# Altium schematic sheet config-interface.SchDoc
size A; SheetNumber: 5; SheetTotal: 9
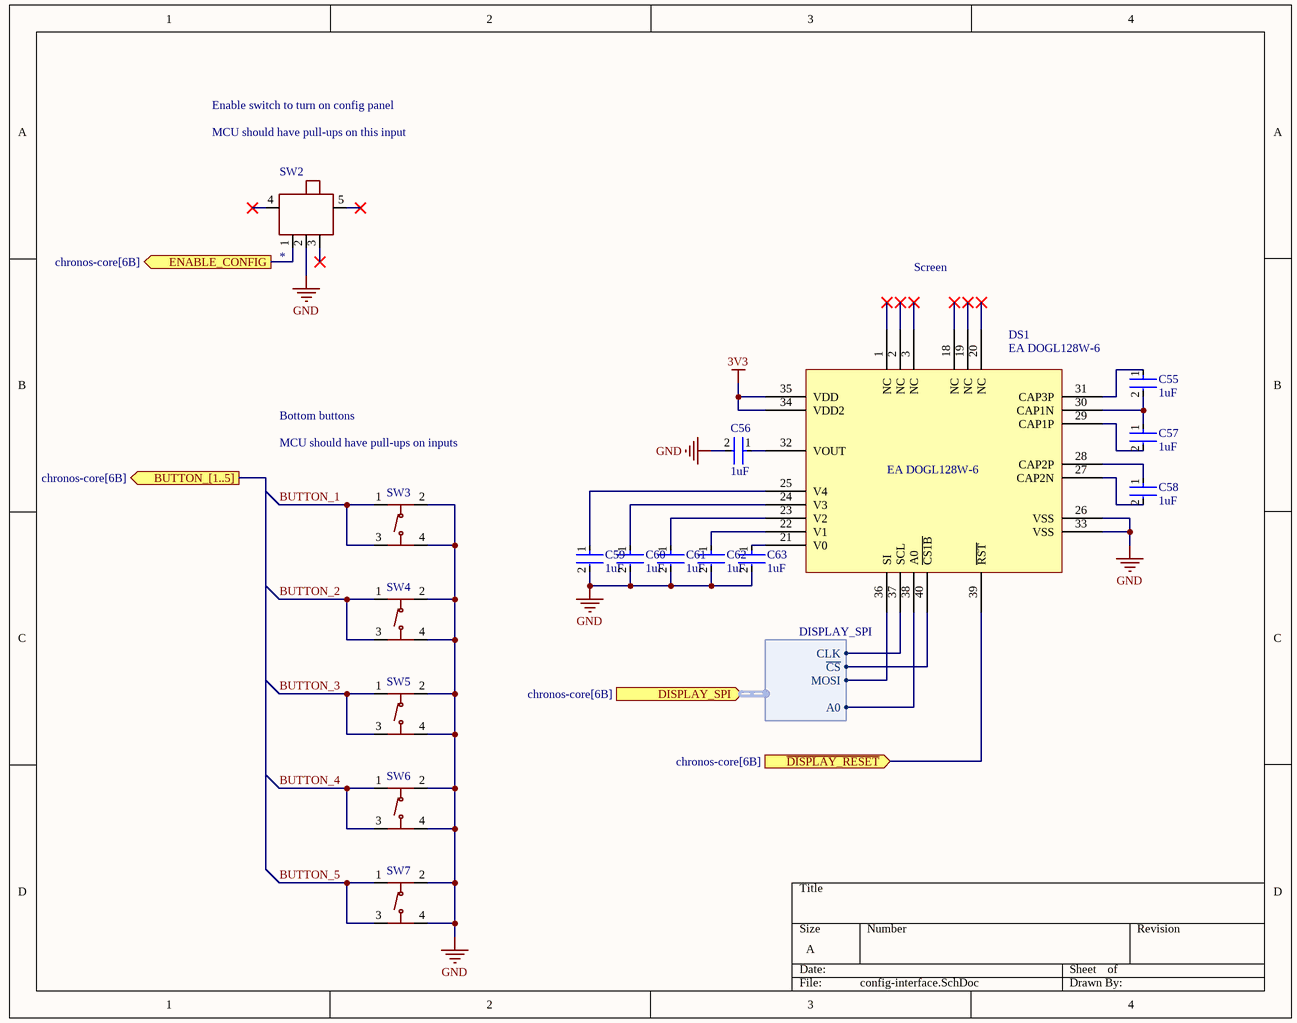
[diagram p0: config-interface.SchDoc]

## Parts
C55  Capacitance: 1uF  [FP-CL542-IPC_C]  (hidden comment: CL05A105KA5NQNC)
C56  Capacitance: 1uF  [FP-CL542-IPC_C]  (hidden comment: CL05A105KA5NQNC)
C57  Capacitance: 1uF  [FP-CL542-IPC_C]  (hidden comment: CL05A105KA5NQNC)
C58  Capacitance: 1uF  [FP-CL542-IPC_C]  (hidden comment: CL05A105KA5NQNC)
C59  Capacitance: 1uF  [FP-CL542-IPC_C]  (hidden comment: CL05A105KA5NQNC)
C60  Capacitance: 1uF  [FP-CL542-IPC_C]  (hidden comment: CL05A105KA5NQNC)
C61  Capacitance: 1uF  [FP-CL542-IPC_C]  (hidden comment: CL05A105KA5NQNC)
C62  Capacitance: 1uF  [FP-CL542-IPC_C]  (hidden comment: CL05A105KA5NQNC)
C63  Capacitance: 1uF  [FP-CL542-IPC_C]  (hidden comment: CL05A105KA5NQNC)
DS1  EA DOGL128W-6  [EA DOGL128W-6]
SW2  SS12D07VG4 087  [SS12D07VG4 087]  (value not drawn)
SW3  TS-1187A-B-A-B  [TS-1187A-B-A-B]  (value not drawn)
SW4  TS-1187A-B-A-B  [TS-1187A-B-A-B]  (value not drawn)
SW5  TS-1187A-B-A-B  [TS-1187A-B-A-B]  (value not drawn)
SW6  TS-1187A-B-A-B  [TS-1187A-B-A-B]  (value not drawn)
SW7  TS-1187A-B-A-B  [TS-1187A-B-A-B]  (value not drawn)

## Ports
BUTTON_[1..5] (out, see chronos-core[6B]), DISPLAY_SPI (in, harness DISPLAY_SPI, see chronos-core[6B]), ENABLE_CONFIG (out, see chronos-core[6B]), ~{DISPLAY_RESET} (in, see chronos-core[6B])

## Harnesses
DISPLAY_SPI: CLK, ~{CS}, MOSI, A0

## Nets
3V3: DS1.34(VDD2) DS1.35(VDD)
GND: C56.2 C59.2 C60.2 C61.2 C62.2 C63.2 DS1.26(VSS) DS1.33(VSS) SW2.2 SW3.2(B) SW3.4(D) SW4.2(B) SW4.4(D) SW5.2(B) SW5.4(D) SW6.2(B) SW6.4(D) SW7.2(B) SW7.4(D)
~{DISPLAY_RESET}: DS1.39(~{RST}) ; port ~{DISPLAY_RESET}
BUTTON_1: SW3.1(A) SW3.3(C)
BUTTON_2: SW4.1(A) SW4.3(C)
BUTTON_3: SW5.1(A) SW5.3(C)
BUTTON_4: SW6.1(A) SW6.3(C)
BUTTON_5: SW7.1(A) SW7.3(C)
ENABLE_CONFIG: SW2.1 ; port ENABLE_CONFIG
NetC55_1: C55.1 DS1.31(CAP3P)
NetC55_2: C55.2 C57.1 DS1.30(CAP1N)
NetC56_1: C56.1 DS1.32(VOUT)
NetC57_2: C57.2 DS1.29(CAP1P)
NetC58_1: C58.1 DS1.28(CAP2P)
NetC58_2: C58.2 DS1.27(CAP2N)
NetC59_1: C59.1 DS1.25(V4)
NetC60_1: C60.1 DS1.24(V3)
NetC61_1: C61.1 DS1.23(V2)
NetC62_1: C62.1 DS1.22(V1)
NetC63_1: C63.1 DS1.21(V0)
NetDS1_36: DS1.36(SI) ; port DISPLAY_SPI.MOSI
NetDS1_37: DS1.37(SCL) ; port DISPLAY_SPI.CLK
NetDS1_38: DS1.38(A0) ; port DISPLAY_SPI.A0
NetDS1_40: DS1.40(~{CS1B}) ; port DISPLAY_SPI.~{CS}

Not connected (* = marked no-connect by the designer): DS1 1(NC)* 2(NC)* 3(NC)* 18(NC)* 19(NC)* 20(NC)*; SW2 3* 4* 5*

## Notes on the sheet
- Enable switch to turn on config panel
- MCU should have pull-ups on this input
- Screen
- Bottom buttons
- MCU should have pull-ups on inputs

## Library data of the parts
C55-C63 = CMP-13271-001051-1: Cap Ceramic 1uF 25V X5R ±10% SMD 0402 +85°C Paper T/R; Radiation Hardening: No; Lead Free: Lead Free; Package Quantity: 10000; Max Operating Temperature: 85°C; Voltage Rating: 25V; Case/Package: 0402; Min Operating Temperature: -55°C; Packaging: Tape and Reel; Tolerance: 10%; Height: 0.5mm; Thickness: 0.022inch; Case Code (Metric): 1005; Width: 0.02inch; Case Code (Imperial): 0402; Dielectric: X5R; Length: 1mm; Mount: Surface Mount; Material: Ceramic; Depth: 0.5mm
SW2 = SS12D07VG4 087: Slide Switches. SS12D07VG4 087; Manufacturer: SHOU HAN(); Component Type: Switches; Design Item ID: SS12D07VG4 087; Value: *; JLCPCB Part #: C2939726; Manufacturer Part Number: SS12D07VG4 087
SW3-SW7 = TS-1187A-B-A-B: Tactile Switches. -30C~+85C 1.5mm 1.6N 100,000 cycles 12V 5.1mm 5.1mm 50mA Gold No Round Button SPST Surface Mount,Vertical Without Bracket SMD-4P,5.1x5.1mm Tactile Switches ROHS; Manufacturer: XKB Connection; Component Type: Switches; Design Item ID: TS-1187A-B-A-B; Value: *; JLCPCB Part #: C318884; Manufacturer Part Number: TS-1187A-B-A-B
DS1 = EA DOGL128W-6: Supplier 1: DigiKey; Supplier Part Number 1: 1481-1058-ND